# Altium schematic sheet Coil.SchDoc
size A4
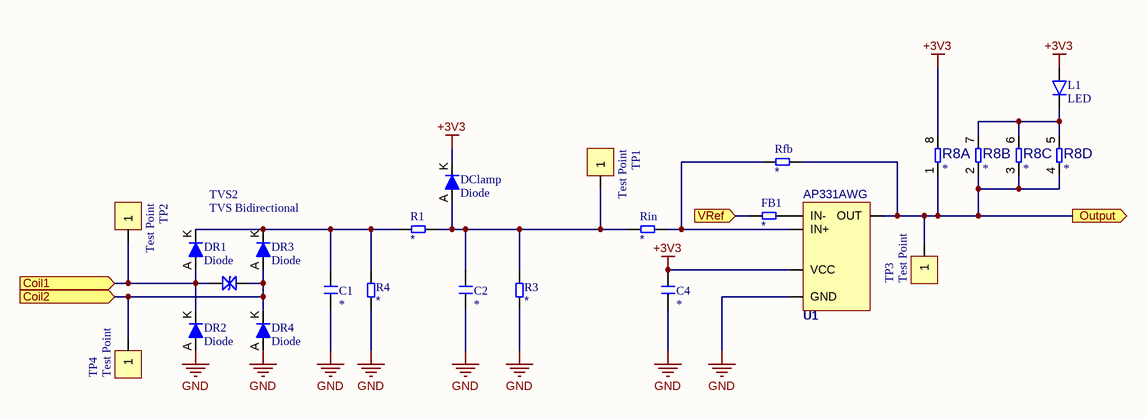
[diagram p0: Coil.SchDoc]

## Parts
C1  *  [C0603_N]
C2  *  [C0603_N]
C4  *  [C0603_N]
DClamp  Diode  [SOD323F]
DR1  Diode  [SOD323F]
DR2  Diode  [SOD323F]
DR3  Diode  [SOD323F]
DR4  Diode  [SOD323F]
FB1  Resistor  [R0603]  (value not drawn)
L1  LED  [LED 0603/1608]
R1  Resistor  [R0603]  (value not drawn)
R3  Resistor  [R0603]  (value not drawn)
R4  Resistor  [R0603]  (value not drawn)
R8  Resistor Array - 4P  [YC164]  (value not drawn)  (parts A,B,C,D of 4)
Rfb  Resistor  [R0603]  (value not drawn)
Rin  Resistor  [R0603]  (value not drawn)
TP1  Test Point  [Harwin S2751-46R]
TP2  Test Point  [Harwin S2751-46R]
TP3  Test Point  [Harwin S2751-46R]
TP4  Test Point  [Harwin S2751-46R]
TVS2  TVS Bidirectional  [SOD323F-Comchip Variant]
U1  AP331AWG  [SOT23-5_N]

## Ports
Coil1 (in), Coil2 (in), Output (out), VRef (in)

## Nets
+3V3: C4.1 DClamp.K L1.2(A) R8.8 U1.5(VCC)
GND: C1.2 C2.2 C4.2 DR2.A DR4.A R3.1 R4.1 U1.2(GND)
Coil1: DR1.A DR2.K TP2.1 TVS2.2 ; port Coil1
Coil2: DR3.A DR4.K TP4.1 TVS2.1 ; port Coil2
Output: R8.1 R8.2 R8.3 R8.4 Rfb.2 TP3.1 U1.4(OUT) ; port Output
VRef: FB1.1 ; port VRef
NetC1_1: C1.1 DR1.K DR3.K R1.1 R4.2
NetC2_1: C2.1 DClamp.A R1.2 R3.2 Rin.1 TP1.1
NetFB1_2: FB1.2 U1.1(IN-)
NetL1_1: L1.1(K) R8.5 R8.6 R8.7
NetRfb_1: Rfb.1 Rin.2 U1.3(IN+)

## Library data of the parts
C1 C2 C4 = Capacitor: Capacitor MLCC; Manufacturer: Yageo; Manufacturer Part Number: CC0603KRX7R9BB104; Tolerance (%): 10; Category: Capacitor; Package: 0603; Value: *; Supplier Part Number 1: 1362556; Supplier 1: Farnell; ComponentLink1URL: http://www.yageo.com; ComponentLink1Description: Manufacturer Website; Voltage Rating (Volts): *; Supplier 2: Digi-Key; Supplier Part Number 2: 311-1344-1-ND
FB1 R1 R3 R4 Rfb Rin = Resistor: Published: 17-Dec-2003; LatestRevisionDate: 19-Mar-2004; LatestRevisionNote: Silkscreen size reduced.; PackageDocument: Mar-2003; PackageReference: 3-0603; Publisher: Altium Limited; Code_IPC: 1608 [0603]; ComponentLink1Description: Manufacturer Link; ComponentLink1URL: http://www.panasonic.com/industrial/components/resistive_products.htm; ComponentLink2Description: Datasheet; ComponentLink2URL: http://www.panasonic.com/industrial/components/pdf/AOA0000CE2.pdf; Value: *
R8 = Resistor Array - 4P: Value: *